# EAGLE schematic 2021-04-10 BOSS-RoboClaw-Interface (EAGLE 9.6.2)
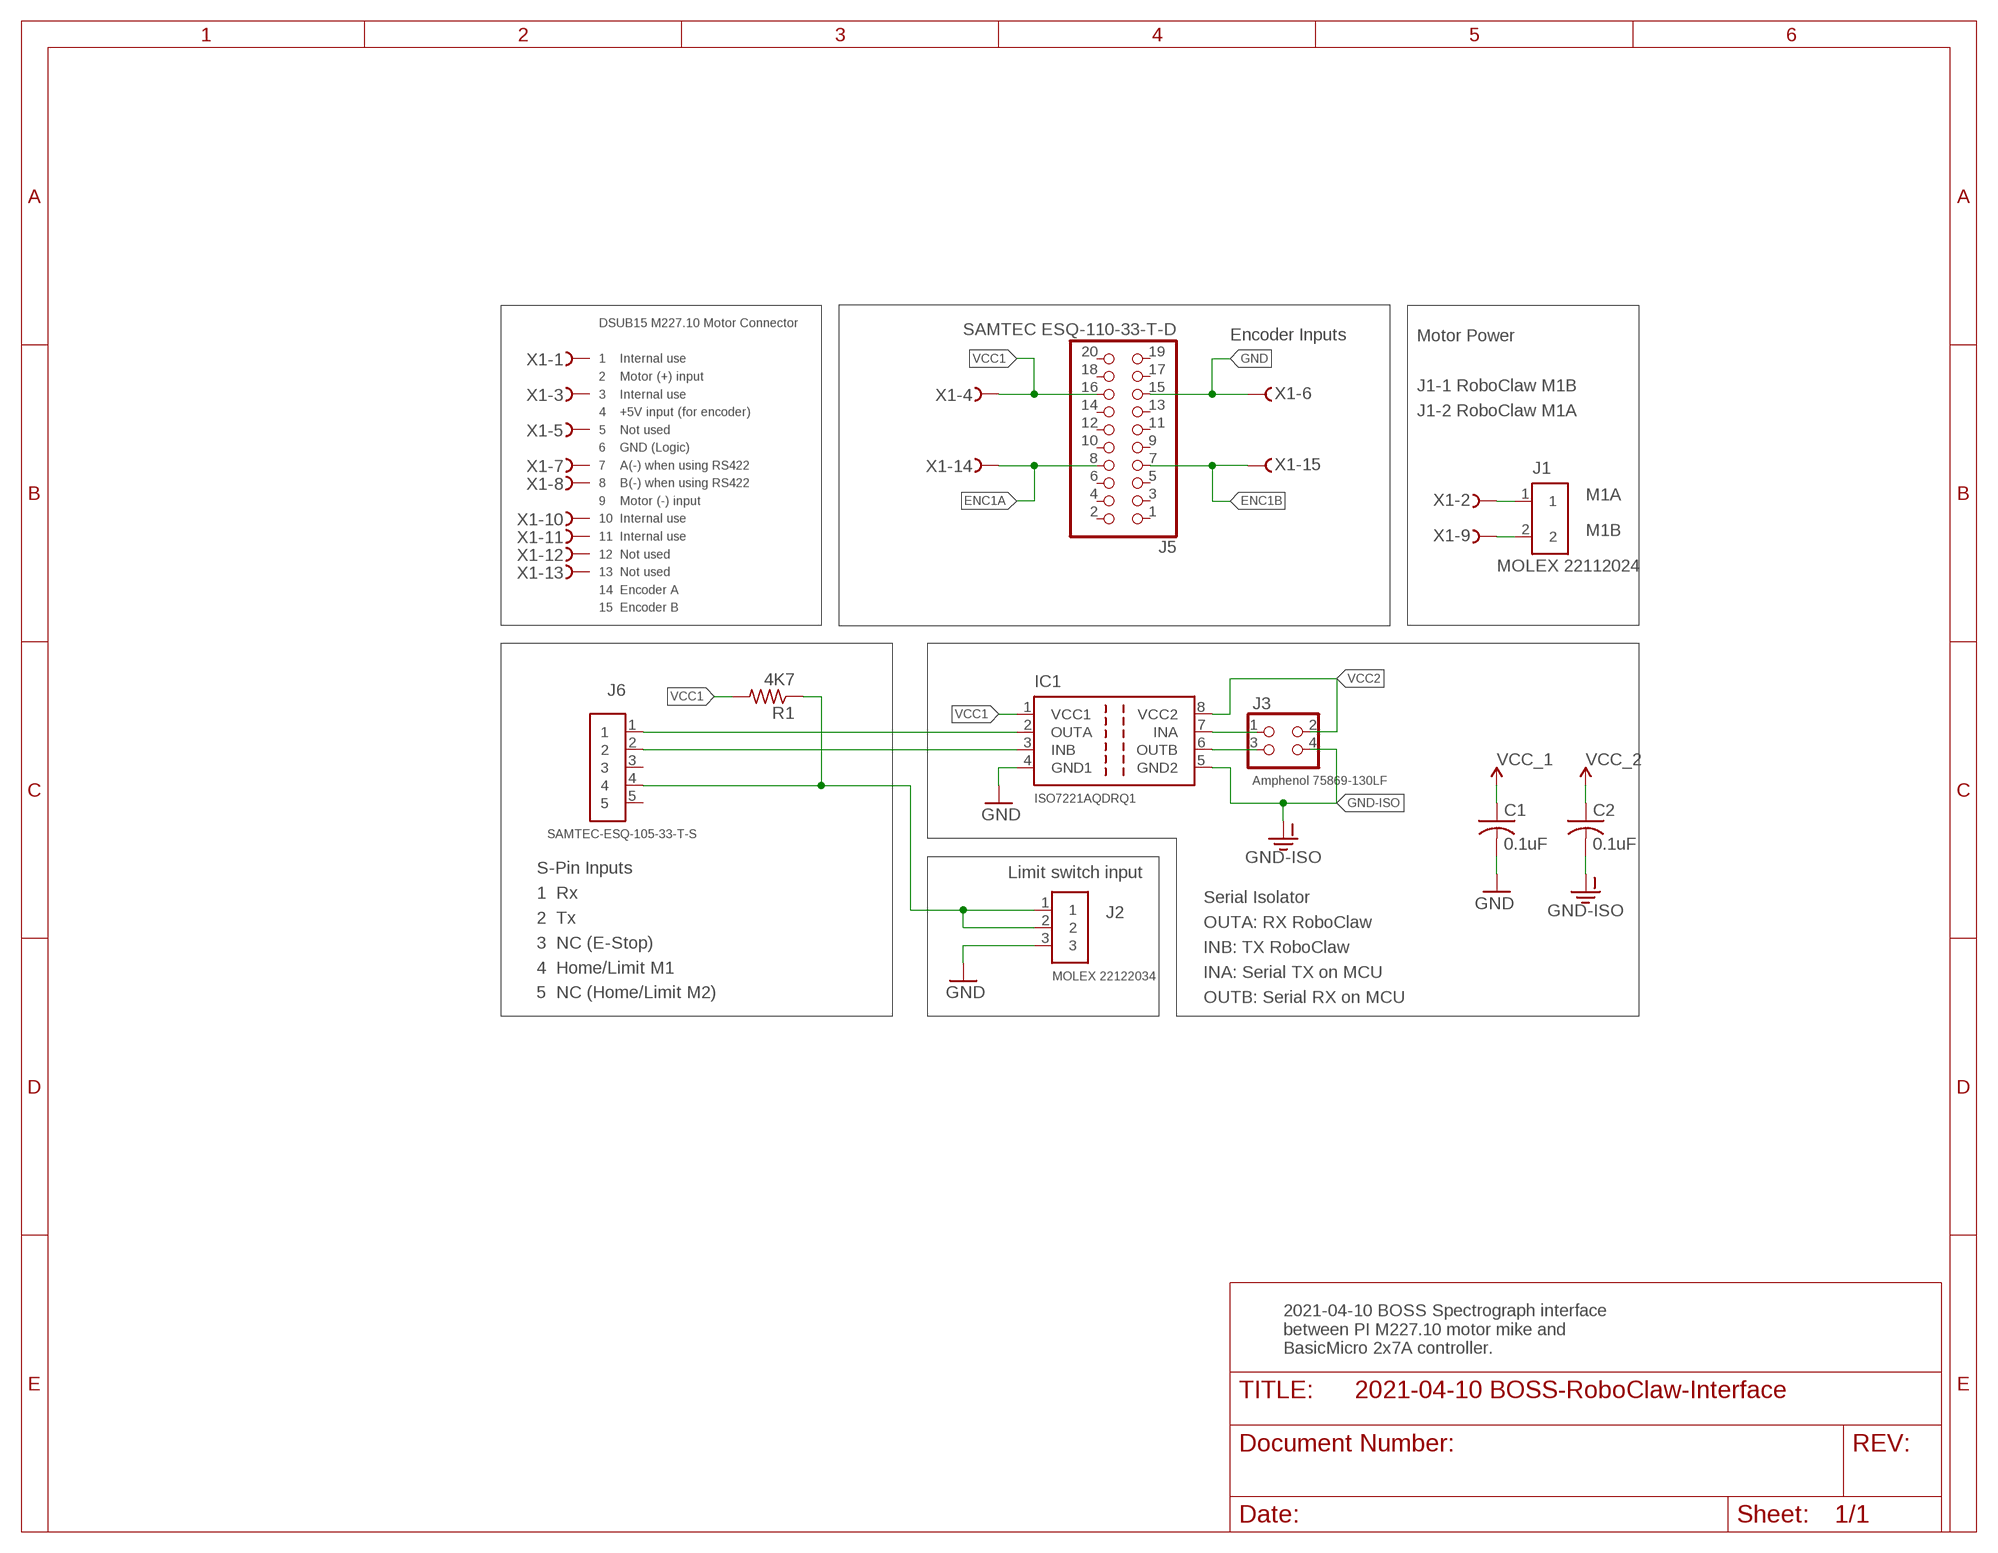
[diagram p0: schematic, sheet 1]

## Parts
C1  0.1uF  C-USC0805  [C0805]
C2  0.1uF  C-USC0805  [C0805]
IC1  ISO7221AQDRQ1  ISO7221ISO7221  [SO-08-ISO7221]
J1  MOLEX 22112024  PINHD-1X2-MOLEX-22112022  [1X02-MOLEX-22112022]
J2  MOLEX 22122034  PINHD-1X3RA-MOLEX-22122034  [1X03RA-MOLEX-22122034]
J3  Amphenol 75869-130LF  PINHD-2X2AMP-75869-130LF  [2X02-SHROUD]
J5  SAMTEC ESQ-110-33-T-D  PINHD-2X10-ESQ-110-33-T-DSAMTEC  [2X10-ESQ-110-33-T-D]
J6  SAMTEC-ESQ-105-33-T-S  PINHD-1X5-ESQ-105-33-T-S  [1X05-ESQ-105-33-T-S]
R1  4K7  R-US_R0805  [R0805]
X1  Amphenol L77SDAH15SOL2RM8C309  D-SUB15-H2R15ST  [H2R15ST]

## Nets
ENC1A: J5.8 X1.14
ENC1B: J5.7 X1.15
GND: C1.2 IC1.4(GND1) J2.3 J5.15 X1.6
GND-ISO: C2.2 IC1.5(GND2) J3.4
LIMIT: J2.1 J2.2 J6.4 R1.1
M1A: J1.1 X1.2
M1B: J1.2 X1.9
ROBO0TX: IC1.3(INB) J6.2
ROBO-RX: IC1.2(OUTA) J6.1
RX: IC1.7(INA) J3.1
TX: IC1.6(OUTB) J3.3
VCC1: C1.1 IC1.1(VCC1) J5.16 R1.2 X1.4 ; supply symbol labelled VCC_1
VCC2: C2.1 IC1.8(VCC2) J3.2 ; supply symbol labelled VCC_2
Unconnected: J5.1 J5.2 J5.3 J5.4 J5.5 J5.6 J5.9 J5.10 J5.11 J5.12 J5.13 J5.14 J5.17 J5.18 J5.19 J5.20 J6.3 J6.5 X1.1 X1.3 X1.5 X1.7 X1.8 X1.10 X1.11 X1.12 X1.13

## Notes on the sheet
- Encoder Inputs
- Motor Power
  
  J1-1 RoboClaw M1B
  J1-2 RoboClaw M1A
- DSUB15 M227.10 Motor Connector
  
  1    Internal use
  2    Motor (+) input
  3    Internal use
  4    +5V input (for encoder)
  5    Not used
  6    GND (Logic)
  7    A(-) when using RS422
  8    B(-) when using RS422
  9    Motor (-) input
  10  Internal use
  11  Internal use
  12  Not used
  13  Not used
  14  Encoder A
  15  Encoder B
- Limit switch input
- S-Pin Inputs
  1  Rx
  2  Tx
  3  NC (E-Stop)
  4  Home/Limit M1
  5  NC (Home/Limit M2)
- Serial Isolator
  OUTA: RX RoboClaw
  INB: TX RoboClaw
  INA: Serial TX on MCU
  OUTB: Serial RX on MCU
- 2021-04-10 BOSS Spectrograph interface
  between PI M227.10 motor mike and
  BasicMicro 2x7A controller.

## Library data of the parts
C1 C2 = AUmlib:C-US: CAPACITOR, American symbol; SPICEPREFIX: C
IC1 = AUmlib:ISO7221: DUAL DIGITAL ISOLATORS Source: http://focus.ti.com/lit/ds/symlink/iso7221a.pdf
J1 = AUmlib:PINHD-1X2-MOLEX-22112022
J2 = AUmlib:PINHD-1X3RA-MOLEX-22122034
J3 = AUmlib:PINHD-2X2: PIN HEADER
J5 = AUmlib:PINHD-2X10-ESQ-110-33-T-D: PIN HEADER
J6 = AUmlib:PINHD-1X5-ESQ-105-33-T-S
R1 = AUmlib:R-US_: RESISTOR, American symbol; SPICEPREFIX: R
X1 = AUmlib:D-SUB15-: D-Subminiatur Connector Source: Electronioc Interconnects European Edition 1998; OC_FARNELL: unknown; OC_NEWARK: unknown